# Altium schematic sheet MCU.SchDoc
size 431 x 279 mm; SheetNumber: 1; SheetTotal: 1
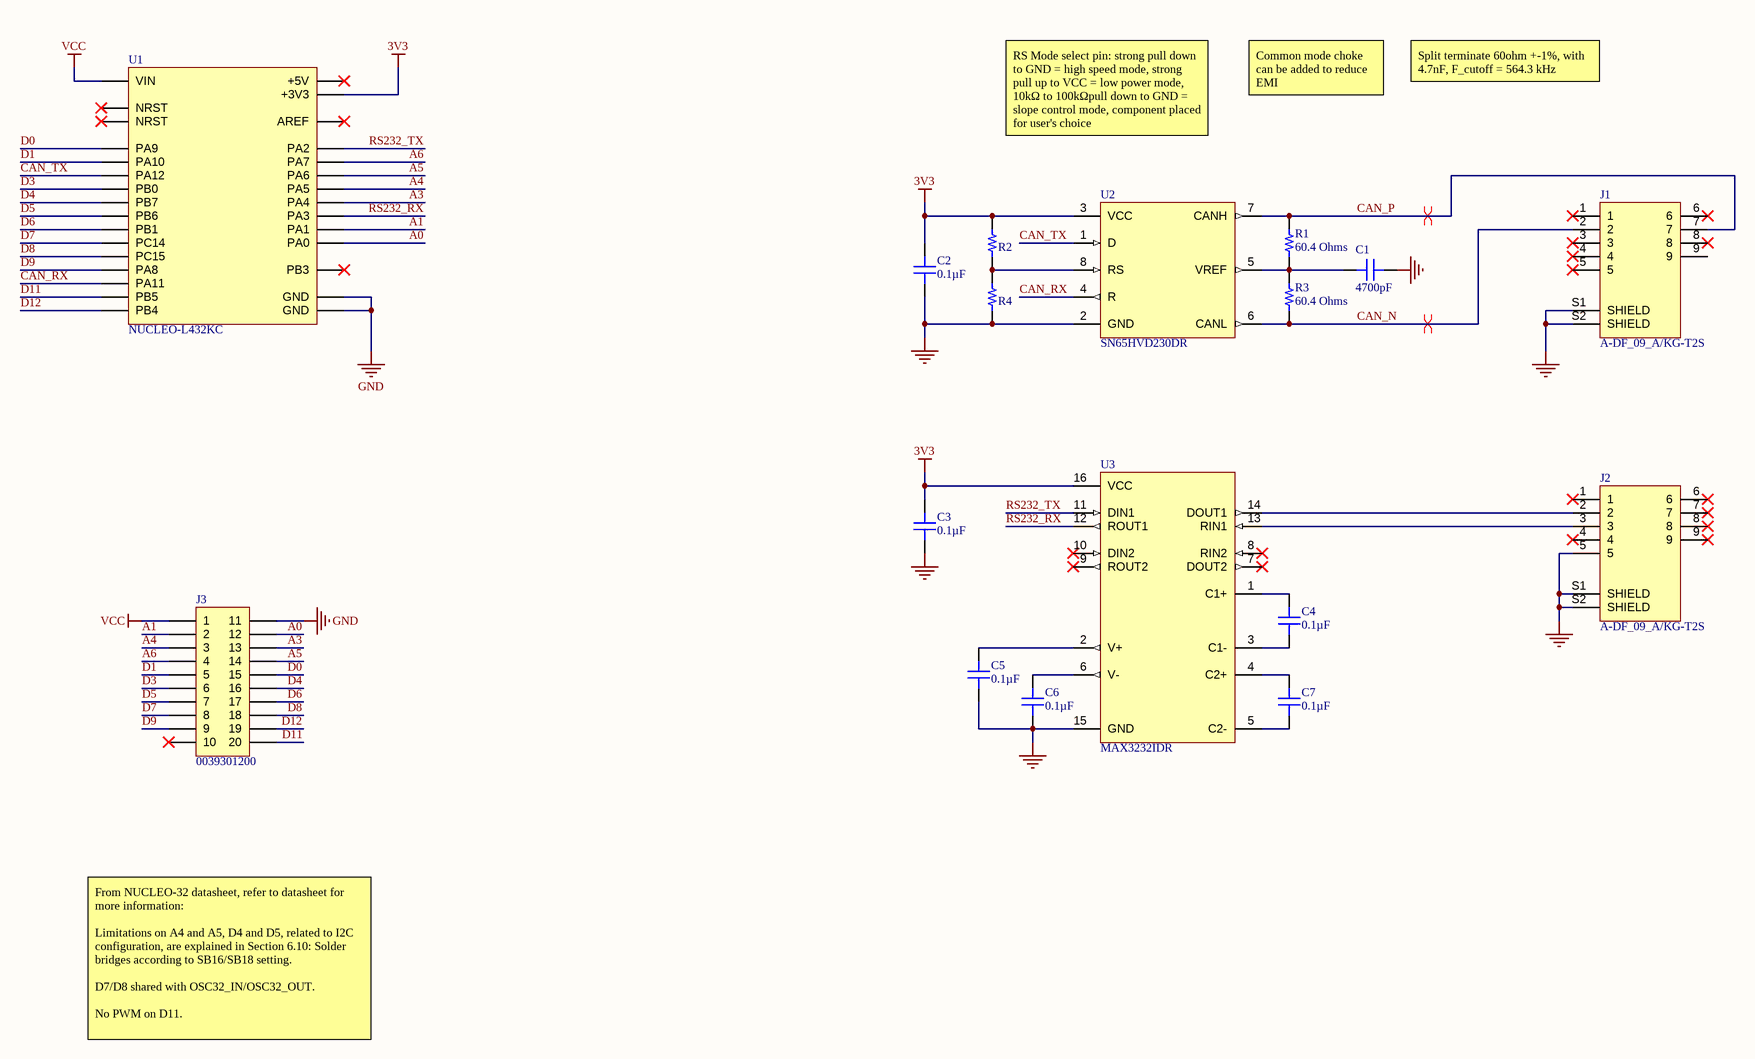
[diagram p0: MCU.SchDoc]

## Parts
C1  4700pF  [CAP 0603_1608]
C2  0.1µF  [CAP 0603_1608]
C3  0.1µF  [CAP 0603_1608]
C4  0.1µF  [CAP 0603_1608]
C5  0.1µF  [CAP 0603_1608]
C6  0.1µF  [CAP 0603_1608]
C7  0.1µF  [CAP 0603_1608]
J1  A-DF_09_A/KG-T2S  [ASSMANN_A-DF09A/KG-T2S]
J2  A-DF_09_A/KG-T2S  [ASSMANN_A-DF09A/KG-T2S]
J3  0039301200  [MOLEX_0039301200]
R1  60.4 Ohms  [RES 0603_1608]
R2  (no value)  [RES 0805_2012]
R3  60.4 Ohms  [RES 0603_1608]
R4  (no value)  [RES 0805_2012]
U1  NUCLEO-L432KC  [MODULE_NUCLEO-L432KC]
U2  SN65HVD230DR  [SOIC127P599X175-8N]
U3  MAX3232IDR  [SOIC127P600X175-16N]

## Nets
3V3: C2.2 C3.2 R2.2 U1.CN4_14(+3V3) U2.3(VCC) U3.16(VCC)
GND: C1.2 C2.1 C3.1 C5.1 C6.1 J1.S1(SHIELD) J1.S2(SHIELD) J2.5 J2.S1(SHIELD) J2.S2(SHIELD) J3.11 R4.1 U1.CN3_4(GND) U1.CN4_2(GND) U2.2(GND) U3.15(GND)
VCC: J3.1 U1.CN4_1(VIN)
A0: J3.12 U1.CN4_12(PA0)
A1: J3.2 U1.CN4_11(PA1)
A3: J3.13 U1.CN4_9(PA4)
A4: J3.3 U1.CN4_8(PA5)
A5: J3.14 U1.CN4_7(PA6)
A6: J3.4 U1.CN4_6(PA7)
CAN_N: J1.2 R3.2 U2.6(CANL)
CAN_P: J1.7 R1.1 U2.7(CANH)
CAN_RX: U1.CN3_13(PA11) U2.4(R)
CAN_TX: U1.CN3_5(PA12) U2.1(D)
D0: J3.15 U1.CN3_1(PA9)
D1: J3.5 U1.CN3_2(PA10)
D3: J3.6 U1.CN3_6(PB0)
D4: J3.16 U1.CN3_7(PB7)
D5: J3.7 U1.CN3_8(PB6)
D6: J3.17 U1.CN3_9(PB1)
D7: J3.8 U1.CN3_10(PC14)
D8: J3.18 U1.CN3_11(PC15)
D9: J3.9 U1.CN3_12(PA8)
D11: J3.20 U1.CN3_14(PB5)
D12: J3.19 U1.CN3_15(PB4)
RS232_RX: U1.CN4_10(PA3) U3.12(ROUT1)
RS232_TX: U1.CN4_5(PA2) U3.11(DIN1)
NetC1_1: C1.1 R1.2 R3.1 U2.5(VREF)
NetC4_1: C4.1 U3.3(C1-)
NetC4_2: C4.2 U3.1(C1+)
NetC5_2: C5.2 U3.2(V+)
NetC6_2: C6.2 U3.6(V-)
NetC7_1: C7.1 U3.5(C2-)
NetC7_2: C7.2 U3.4(C2+)
NetJ2_2: J2.2 U3.14(DOUT1)
NetJ2_3: J2.3 U3.13(RIN1)
NetR2_1: R2.1 R4.2 U2.8(RS)

Not connected (* = marked no-connect by the designer): J1 1* 3* 4* 5* 6* 8* 9; J2 1* 4* 6* 7* 8* 9*; J3 10*; U1 CN3_3(NRST)* CN4_3(NRST)* CN4_4(+5V)* CN4_13(AREF)* CN4_15(PB3)*; U3 7(DOUT2)* 8(RIN2)* 9(ROUT2)* 10(DIN2)*

## Layout directives
differential pair: CAN_N, CAN_P

## Notes on the sheet
- Common mode choke can be added to reduce EMI
- Split terminate 60ohm +-1%, with 4.7nF, F_cutoff = 564.3 kHz
- RS Mode select pin: strong pull down to GND = high speed mode, strong
  pull up to VCC = low power mode, 10kΩ to 100kΩpull down to GND = slope control mode, component placed for user's choice
- From NUCLEO-32 datasheet, refer to datasheet for more information:
  Limitations on A4 and A5, D4 and D5, related to I2C configuration, are explained in Section 6.10: Solder
  bridges according to SB16/SB18 setting.
  D7/D8 shared with OSC32_IN/OSC32_OUT.
  No PWM on D11.
- Title
- Project
- Scale
- Size
- B
- Part Number
- Engineer
- Sheet
- of
- Rev

## Library data of the parts
C1 = CGA3E2X7R1H472K080AA: CAP CER 4700PF 50V X7R 0603; Manufacturer: TDK Corporation; Tolerance: ±10%; Part Number: CGA3E2X7R1H472K080AA; Value: 4700pF; Applications: Automotive; Capacitance: 4700pF; ComponentLink1Description: Datasheet; ComponentLink1URL: https://product.tdk.com/info/en/catalog/datasheets/mlcc_automotive_general_en.pdf?ref_disty=digikey; ComponentLink2Description: DigiKey Link; ComponentLink2URL: http://digikey.com/product-detail/en/tdk-corporation/CGA3E2X7R1H472K080AA/445-5661-1-ND/2443701; Device Package: 0603 (1608 Metric); LastUpdated: 9/2/2020 1:03:30 AM; Lifecycle Status: Active; Minimum Order: 1; Mounting Type: Surface Mount, MLCC; Operating Temperature: -55°C ~ 125°C; Package / Case: 0603 (1608 Metric); Packaging: TapeAndReel; PartId: 5842; Part Status: Active; Price: 0.01; Ratings: AEC-Q200; Series: CGA; Size / Dimension: 0.063" L x 0.031" W (1.60mm x 0.80mm); Supplier 1: DigiKey; Supplier Part Number 1: 445-5661-1-ND; Temperature Coefficient: X7R; Thickness (Max): 0.035" (0.90mm); Voltage - Rated: 50V
C2-C7 = CL10B104KA8NNNC: CAP CER 0.1UF 25V X7R 0603; Manufacturer: Samsung Electro-Mechanics; Tolerance: ±10%; Part Number: CL10B104KA8NNNC; Value: 0.1µF; Applications: General Purpose; Capacitance: 0.1µF; ComponentLink1Description: Datasheet; ComponentLink1URL: http://www.samsungsem.com/kr/support/product-search/mlcc/CL10B104KA8NNNC.jsp; ComponentLink2Description: DigiKey Link; ComponentLink2URL: http://digikey.com/product-detail/en/samsung-electro-mechanics/CL10B104KA8NNNC/1276-1006-1-ND/3889092; Device Package: 0603 (1608 Metric); LastUpdated: 9/2/2020 1:03:22 AM; Lifecycle Status: Active; Minimum Order: 1; Mounting Type: Surface Mount, MLCC; Operating Temperature: -55°C ~ 125°C; Package / Case: 0603 (1608 Metric); Packaging: TapeAndReel; PartId: 9793; Part Status: Active; Price: 0.01; Series: CL; Size / Dimension: 0.063" L x 0.031" W (1.60mm x 0.80mm); Supplier 1: DigiKey; Supplier Part Number 1: 1276-1006-1-ND; Temperature Coefficient: X7R; Thickness (Max): 0.035" (0.90mm); Voltage - Rated: 25V
J1 J2 = A-DF_09_A/KG-T2S: Conn D-Subminiature F 9 POS 2.77mm Solder RA Thru-Hole 9 Terminal 1 Port; MF: {'manufacturer': u'Assmann WSW'}; Availability: Unavailable; Value: *; MP: A-DF_09_A/KG-T2S; Package: None; Price: None
J3 = 0039301200: Connector Header Through Hole, Right Angle 20 position 0.165" (4.20mm)
R1 R3 = RMCF0603FT60R4: RES 60.4 OHM 1% 1/10W 0603; Manufacturer: Stackpole Electronics Inc; Power (Watts): 0.1W, 1/10W; Temperature Coefficient: ±100ppm/°C; Part Number: RMCF0603FT60R4; Value: 60.4 Ohms; ComponentLink1Description: Datasheet; ComponentLink1URL: https://www.seielect.com/catalog/sei-rmcf_rmcp.pdf; ComponentLink2Description: DigiKey Link; ComponentLink2URL: http://digikey.com/product-detail/en/stackpole-electronics-inc/RMCF0603FT60R4/RMCF0603FT60R4CT-ND/2418105; Composition: Thick Film; Device Package: 0603 (1608 Metric); Features: Automotive AEC-Q200; Height - Seated (Max): 0.022" (0.55mm); LastUpdated: 9/2/2020 1:10:13 AM; Lifecycle Status: Active; Minimum Order: 1; Number of Terminations: 2; Operating Temperature: -55°C ~ 155°C; Package / Case: 0603 (1608 Metric); Packaging: CutTape; PartId: 10803; Part Status: Active; Price: 0.10; Ratings: AEC-Q200; Resistance: 60.4 Ohms; Series: RMCF; Size / Dimension: 0.061" L x 0.031" W (1.55mm x 0.80mm); Supplier 1: DigiKey; Supplier Part Number 1: RMCF0603FT60R4CT-ND; Supplier Device Package: 0603; Tolerance: ±1%
R2 R4 = CRCW08050000Z0EAC: RES SMD 0 OHM JUMP 1/8W 0805; Manufacturer: Vishay Dale; Power (Watts): 0.125W, 1/8W; Tolerance: Jumper; Part Number: CRCW08050000Z0EAC; ComponentLink1Description: Datasheet; ComponentLink1URL: http://www.vishay.com/docs/28773/crcwce3.pdf; ComponentLink2Description: DigiKey Link; ComponentLink2URL: http://digikey.com/product-detail/en/vishay-dale/CRCW08050000Z0EAC/541-4125-1-ND/7928808; Composition: Thick Film; Device Package: 0805 (2012 Metric); Height - Seated (Max): 0.024" (0.60mm); LastUpdated: 9/2/2020 1:15:03 AM; Lifecycle Status: Active; Minimum Order: 1; Number of Terminations: 2; Operating Temperature: -55°C ~ 155°C; Package / Case: 0805 (2012 Metric); Packaging: CutTape; PartId: 37138; Part Status: Active; Price: 0.10; Series: CRCW-C; Size / Dimension: 0.079" L x 0.049" W (2.00mm x 1.25mm); Supplier 1: DigiKey; Supplier Part Number 1: 541-4125-1-ND; Supplier Device Package: 0805
U1 = NUCLEO-L432KC: STM32 Nucleo-32 development board with STM32L432KC MCU, supports Arduino connectivity; MF: {'manufacturer': u'STMicroelectronics'}; Price: None; Value: *; Availability: Unavailable; Package: None; MP: NUCLEO-L432KC
U2 = SN65HVD230DR: 3.3 V CAN Transceiver with Standby Mode 8-SOIC -40 to 85; MF: {'manufacturer': u'Texas Instruments'}; Availability: Unavailable; Value: *; MP: SN65HVD230DR; Package: None; Price: None
U3 = MAX3232IDR: 3-V to 5.5-V multichannel RS-232 line driver & receiver 16-SOIC -40 to 85; MF: {'manufacturer': u'Texas Instruments'}; Availability: Unavailable; Value: *; MP: MAX3232IDR; Package: None; Price: None